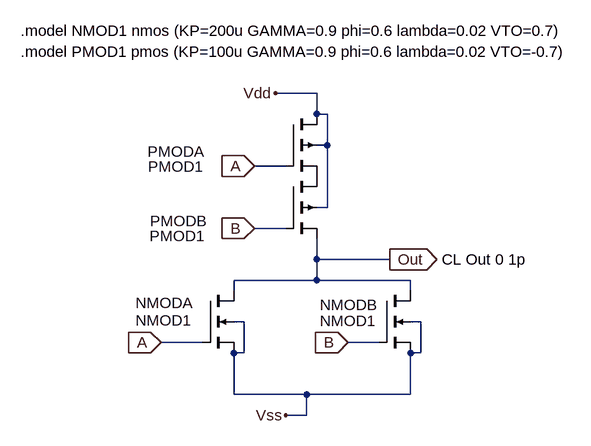
[diagram p0: schematic NOR.asc]
NOR.asc, the LTspice schematic file:
Version 4
SHEET 1 880 680
WIRE 336 -112 272 -112
WIRE 336 -80 336 -112
WIRE 352 -80 336 -80
WIRE 352 -32 352 -80
WIRE 352 -32 336 -32
WIRE 288 0 240 0
WIRE 352 64 352 -32
WIRE 352 64 336 64
WIRE 288 96 240 96
WIRE 336 144 336 112
WIRE 448 144 336 144
WIRE 336 176 336 144
WIRE 336 176 208 176
WIRE 480 176 336 176
WIRE 208 192 208 176
WIRE 480 192 480 176
WIRE 224 240 208 240
WIRE 496 240 480 240
WIRE 160 272 96 272
WIRE 432 272 384 272
WIRE 224 288 224 240
WIRE 224 288 208 288
WIRE 496 288 496 240
WIRE 496 288 480 288
WIRE 208 352 208 288
WIRE 320 352 208 352
WIRE 480 352 480 288
WIRE 480 352 320 352
WIRE 320 384 320 352
WIRE 320 384 288 384
FLAG 96 272 A
IOPIN 96 272 In
FLAG 240 0 A
IOPIN 240 0 In
FLAG 384 272 B
IOPIN 384 272 In
FLAG 240 96 B
IOPIN 240 96 In
FLAG 448 144 Out
IOPIN 448 144 Out
FLAG 288 384 Vss
FLAG 272 -112 Vdd
SYMBOL pmos4 288 -80 R0
WINDOW 0 -213 58 Left 2
WINDOW 3 -212 81 Left 2
SYMATTR InstName PMODA
SYMATTR Value PMOD1
SYMATTR Value2 l=1u w=200u
SYMBOL pmos4 288 16 R0
WINDOW 0 -209 69 Left 2
WINDOW 3 -210 92 Left 2
SYMATTR InstName PMODB
SYMATTR Value PMOD1
SYMATTR Value2 l=1u w=200u
SYMBOL nmos4 160 192 R0
WINDOW 0 -103 19 Left 2
WINDOW 3 -103 46 Left 2
SYMATTR InstName NMODA
SYMATTR Value NMOD1
SYMATTR Value2 l=1u w=50u
SYMBOL nmos4 432 192 R0
WINDOW 0 -91 22 Left 2
WINDOW 3 -91 47 Left 2
SYMATTR InstName NMODB
SYMATTR Value NMOD1
SYMATTR Value2 l=1u w=50u
TEXT -120 -208 Left 2 !.model NMOD1 nmos (KP=200u GAMMA=0.9 phi=0.6 lambda=0.02 VTO=0.7)
TEXT -120 -176 Left 2 !.model PMOD1 pmos (KP=100u GAMMA=0.9 phi=0.6 lambda=0.02 VTO=-0.7)
TEXT 528 144 Left 2 !CL Out 0 1p

The netlist it stands for:
* NOR.asc
M§PMODA Vdd A P001 Vdd PMOD1 l=1u w=200u
M§PMODB P001 B Out Vdd PMOD1 l=1u w=200u
M§NMODA Out A Vss Vss NMOD1 l=1u w=50u
M§NMODB Out B Vss Vss NMOD1 l=1u w=50u
.model NMOS NMOS
.model PMOS PMOS
.lib standard.mos
.model NMOD1 nmos (KP=200u GAMMA=0.9 phi=0.6 lambda=0.02 VTO=0.7)
.model PMOD1 pmos (KP=100u GAMMA=0.9 phi=0.6 lambda=0.02 VTO=-0.7)
CL Out 0 1p
.backanno
.end